# Altium schematic sheet PowerSupply.SchDoc
size A
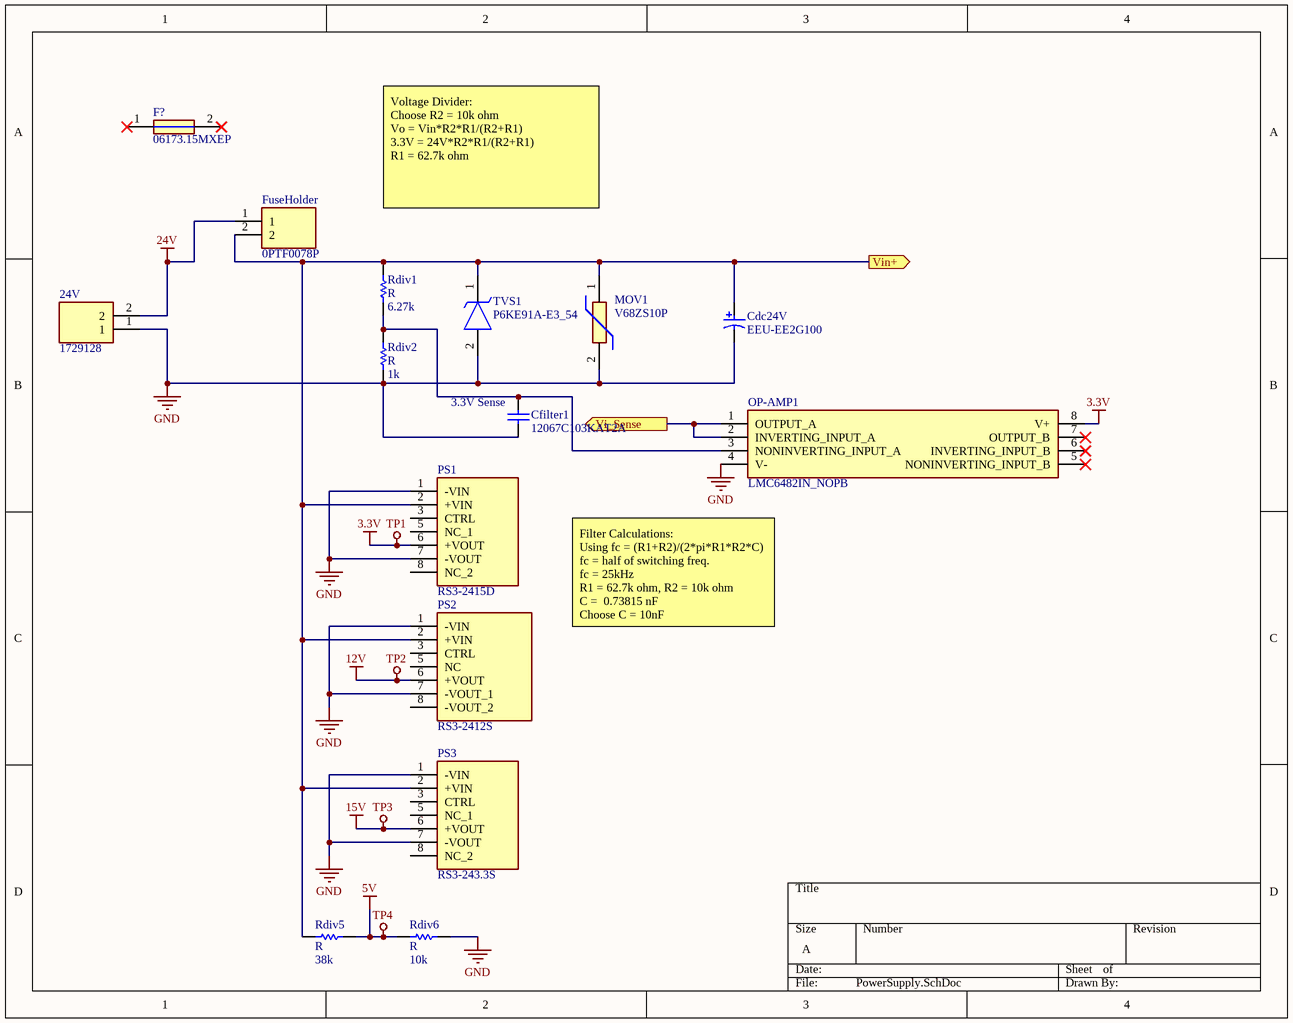
[diagram p0: PowerSupply.SchDoc]

## Parts
24V  1729128  [HDRV2W110P0X508_1X2_1016X810X1000P]
Cdc24V  EEU-EE2G100  [PNSC-EEU-EE2G100-2_V]
Cfilter1  12067C103KAT2A  [CAPC1206(3216)170_N]
F?  06173.15MXEP  [0617315MXEP]
FuseHolder  0PTF0078P  [0PTF0078P]
MOV1  V68ZS10P  [V68ZS10P]
OP-AMP1  LMC6482IN_NOPB  [DIP794W53P254L959H508Q8N]
PS1  RS3-2415D  [RS32405DH3]
PS2  RS3-2412S  [RS32415S]
PS3  RS3-243.3S  [RS32433S]
Rdiv1  R  value 6.27k  [AXIAL-0.3]
Rdiv2  R  value 1k  [AXIAL-0.3]
Rdiv5  R  value 38k  [AXIAL-0.3]
Rdiv6  R  value 10k  [AXIAL-0.3]
TVS1  P6KE91A-E3_54  [DIOAD1910W86L670D310]

## Ports
Vi_Sense (out), Vin+ (out)

## Nets
3.3V: OP-AMP1.8(V+) PS1.6(+VOUT)  [also labelled TP1]
5V: Rdiv5.2 Rdiv6.1  [also labelled TP4]
12V: PS2.6(+VOUT)  [also labelled TP2]
15V: PS3.6(+VOUT)  [also labelled TP3]
24V: 24V.2 FuseHolder.1
GND: 24V.1 Cdc24V.2 Cfilter1.1 MOV1.2 OP-AMP1.4(V-) PS1.1(-VIN) PS1.7(-VOUT) PS2.1(-VIN) PS2.7(-VOUT_1) PS3.1(-VIN) PS3.7(-VOUT) Rdiv2.1 Rdiv6.2 TVS1.2(A)
Vi_Sense: OP-AMP1.1(OUTPUT_A) OP-AMP1.2(INVERTING_INPUT_A) ; port Vi_Sense
Vin+: Cdc24V.1 FuseHolder.2 MOV1.1 PS1.2(+VIN) PS2.2(+VIN) PS3.2(+VIN) Rdiv1.2 Rdiv5.1 TVS1.1(K) ; port Vin+
NetCfilter1_2: Cfilter1.2 OP-AMP1.3(NONINVERTING_INPUT_A) Rdiv1.1 Rdiv2.2

Not connected (* = marked no-connect by the designer): F? 1* 2*; OP-AMP1 5(NONINVERTING_INPUT_B)* 6(INVERTING_INPUT_B)* 7(OUTPUT_B)*; PS1 3(CTRL) 5(NC_1) 8(NC_2); PS2 3(CTRL) 5(NC) 8(-VOUT_2); PS3 3(CTRL) 5(NC_1) 8(NC_2)

## Notes on the sheet
- Voltage Divider:
  Choose R2 = 10k ohm
  Vo = Vin*R2*R1/(R2+R1)
  3.3V = 24V*R2*R1/(R2+R1)
  R1 = 62.7k ohm
- (near Cfilter1) 3.3V Sense
- Filter Calculations:
  Using fc = (R1+R2)/(2*pi*R1*R2*C)
  fc = half of switching freq.
  fc = 25kHz
  R1 = 62.7k ohm, R2 = 10k ohm
  C =  0.73815 nF
  Choose C = 10nF

## Library data of the parts
24V = 1729128: Connector; Manufacturer_Name: Phoenix Contact; Datasheet Link: http://docs-emea.rs-online.com/webdocs/1380/0900766b81380189.pdf; Height: 10mm; Manufacturer_Part_Number: 1729128; Mouser Part Number: 651-1729128; Mouser Price/Stock: https://www.mouser.co.uk/ProductDetail/Phoenix-Contact/1729128?qs=GFUSqQMLmmnCBVBY3dts9w%3D%3D; Arrow Part Number: 1729128; Arrow Price/Stock: https://www.arrow.com/en/products/1729128/phoenix-contact
Cdc24V = CMP-0736-00002-1: Aluminum Electrolytic Capacitor, 10 uF +/- 20%, 400 V, -25 to 105 degC, 2-Pin 10 x 10 x 22 mm Through-hole, RoHS, Tape and Reel; Manufacturer: Panasonic; Ripple Current: 430 mA; Rated Voltage: 400 V; Cap.: 10 uF; Capacitance Tolerance: +/- 20%; ComponentLink2URL: http://industrial.panasonic.com/www-data/pdf/ABA0000/ABA0000CE113.pdf; Mounting Technology: Through Hole; PackageVersion: Nov-12; ComponentLink3URL: http://industrial.panasonic.com/www-data/pdf/ABA0000/ABA0000PE245.pdf; ComponentLink2Description: Datasheet; PartNumber: EEU-EE2G100; DatasheetVersion: Nov-12; PackageDescription: 2-Pin Through-hole, Base 10 x 10 mm, Height 22 mm; PackageReference: EEU-EE2G100-2; ComponentLink1URL: http://industrial.panasonic.com/; Temp. Range: -25 to 105 degC; RoHS: TRUE; Packing: Tape and Reel; ComponentLink1Description: Manufacturer URL; ComponentLink3Description: Package Specification
Cfilter1 = CMP-1037-03540-1: CAP 10nF 500V ±10% 1206 (3216 Metric) Thickness 1.7mm SMD; Tolerance: Â±10%; Case-Metric: 3216; Case-EIA: 1206; Rated Voltage: 500 V; Value: 10nF; Max Thickness: 1.7 mm; Technology: SMT
F? = 06173.15MXEP: Fuse; Manufacturer_Name: LITTELFUSE; Datasheet Link: https://componentsearchengine.com/Datasheets/1/06173.15MXEP.pdf; Height: 5.8mm; Manufacturer_Part_Number: 06173.15MXEP; Mouser Part Number: 576-06173.15MXEP; Mouser Price/Stock: https://www.mouser.co.uk/ProductDetail/Littelfuse/0617315MXEP?qs=aGgfWYEhH7lCEoTlvK5w%252Bw%3D%3D; Arrow Part Number: 06173.15MXEP; Arrow Price/Stock: https://www.arrow.com/en/products/06173.15mxep/littelfuse
FuseHolder = 0PTF0078P: Undefined or Miscellaneous; Manufacturer_Name: LITTELFUSE; Datasheet Link: https://media.digikey.com/pdf/Data%20Sheets/Littelfuse%20PDFs/PTF075_77_78.pdf; Height: 11.5mm; Manufacturer_Part_Number: 0PTF0078P; Mouser Part Number: 576-0PTF0078P; Mouser Price/Stock: https://www.mouser.co.uk/ProductDetail/Littelfuse/0PTF0078P?qs=Co4VkB5J4%2Fsczy6gG8s%2FsA%3D%3D; Arrow Part Number: 0PTF0078P; Arrow Price/Stock: https://www.arrow.com/en/products/0ptf0078p/littelfuse
MOV1 = V68ZS10P: Varistor; Manufacturer_Name: LITTELFUSE; Datasheet Link: http://www.littelfuse.com/~/media/electronics/datasheets/varistors/littelfuse_varistor_za_datasheet.pdf.pdf; Height: 20mm; Manufacturer_Part_Number: V68ZS10P; Mouser Part Number: 576-V68ZS10P; Mouser Price/Stock: https://www.mouser.co.uk/ProductDetail/Littelfuse/V68ZS10P?qs=1%2FWRN91BpNvIRlTsONWDiQ%3D%3D
OP-AMP1 = LMC6482IN_NOPB: Integrated Circuit; Manufacturer_Name: Texas Instruments; Manufacturer_Part_Number: LMC6482IN/NOPB; Datasheet Link: http://www.ti.com/lit/gpn/lmc6482; Height: 5.08mm; Mouser Part Number: 926-LMC6482IN/NOPB; Mouser Price/Stock: https://www.mouser.co.uk/ProductDetail/Texas-Instruments/LMC6482IN-NOPB?qs=QbsRYf82W3EByDDrj8Vijg%3D%3D; Arrow Part Number: LMC6482IN/NOPB; Arrow Price/Stock: https://www.arrow.com/en/products/lmc6482innopb/texas-instruments
PS1 = RS3-243.3S: 24/3.3V Power Supply; Manufacturer_Name: RECOM Power; Datasheet Link: https://www.arrow.com/en/products/rs3-243.3s/recom-power; Height: 11.35mm; Manufacturer_Part_Number: RS3-243.3S; Mouser Part Number: 919-RS3-243.3S; Mouser Price/Stock: https://www.mouser.com/Search/Refine.aspx?Keyword=919-RS3-243.3S; RS Part Number: 0163748P; RS Price/Stock: http://uk.rs-online.com/web/p/products/0163748P
PS2 = RS3-2412S: 24/12V Power Supply; Manufacturer_Name: RECOM Power; Datasheet Link: https://www.recom-power.com/pdf/Econoline/RS3-S_D_Z.pdf; Manufacturer_Part_Number: RS3-2412S; Mouser Part Number: 919-RS3-2412S; Mouser Price/Stock: https://www.mouser.com/Search/Refine.aspx?Keyword=919-RS3-2412S; RS Part Number: 1669097; RS Price/Stock: https://uk.rs-online.com/web/p/products/1669097
PS3 = RS3-2415S: 24/15V Power Supply; Manufacturer_Name: RECOM Power; Datasheet Link: https://www.recom-power.com/pdf/Econoline/RS3-S_D_Z.pdf; Height: 11.35mm; Manufacturer_Part_Number: RS3-2415S; Mouser Part Number: 919-RS3-2415S; Mouser Price/Stock: https://www.mouser.com/Search/Refine.aspx?Keyword=919-RS3-2415S
Rdiv1 = Res1: 1/4W 62.727K ohm Resistor; Published: 8-Jun-2000; LatestRevisionDate: 17-Jul-2002; LatestRevisionNote: Re-released for DXP Platform.; PackageReference: AXIAL-0.3; Publisher: Altium Limited; PackageDescription: Axial Device, Thru-Hole; 2 Leads; 0.3 in Pin Spacing
Rdiv2 Rdiv5 Rdiv6 = Res1: 1/4W 10k ohm Resistor; Published: 8-Jun-2000; LatestRevisionDate: 17-Jul-2002; LatestRevisionNote: Re-released for DXP Platform.; PackageReference: AXIAL-0.3; Publisher: Altium Limited; PackageDescription: Axial Device, Thru-Hole; 2 Leads; 0.3 in Pin Spacing
TVS1 = P6KE91A-E3_54: TVS Diode (Uni-directional); Manufacturer_Name: Vishay; Manufacturer_Part_Number: P6KE91A-E3/54; Datasheet Link: https://www.mouser.com/datasheet/2/427/p6ke-1767850.pdf